# Altium schematic sheet COMECA_Main.SchDoc
size A4; SheetNumber: 1; SheetTotal: 10
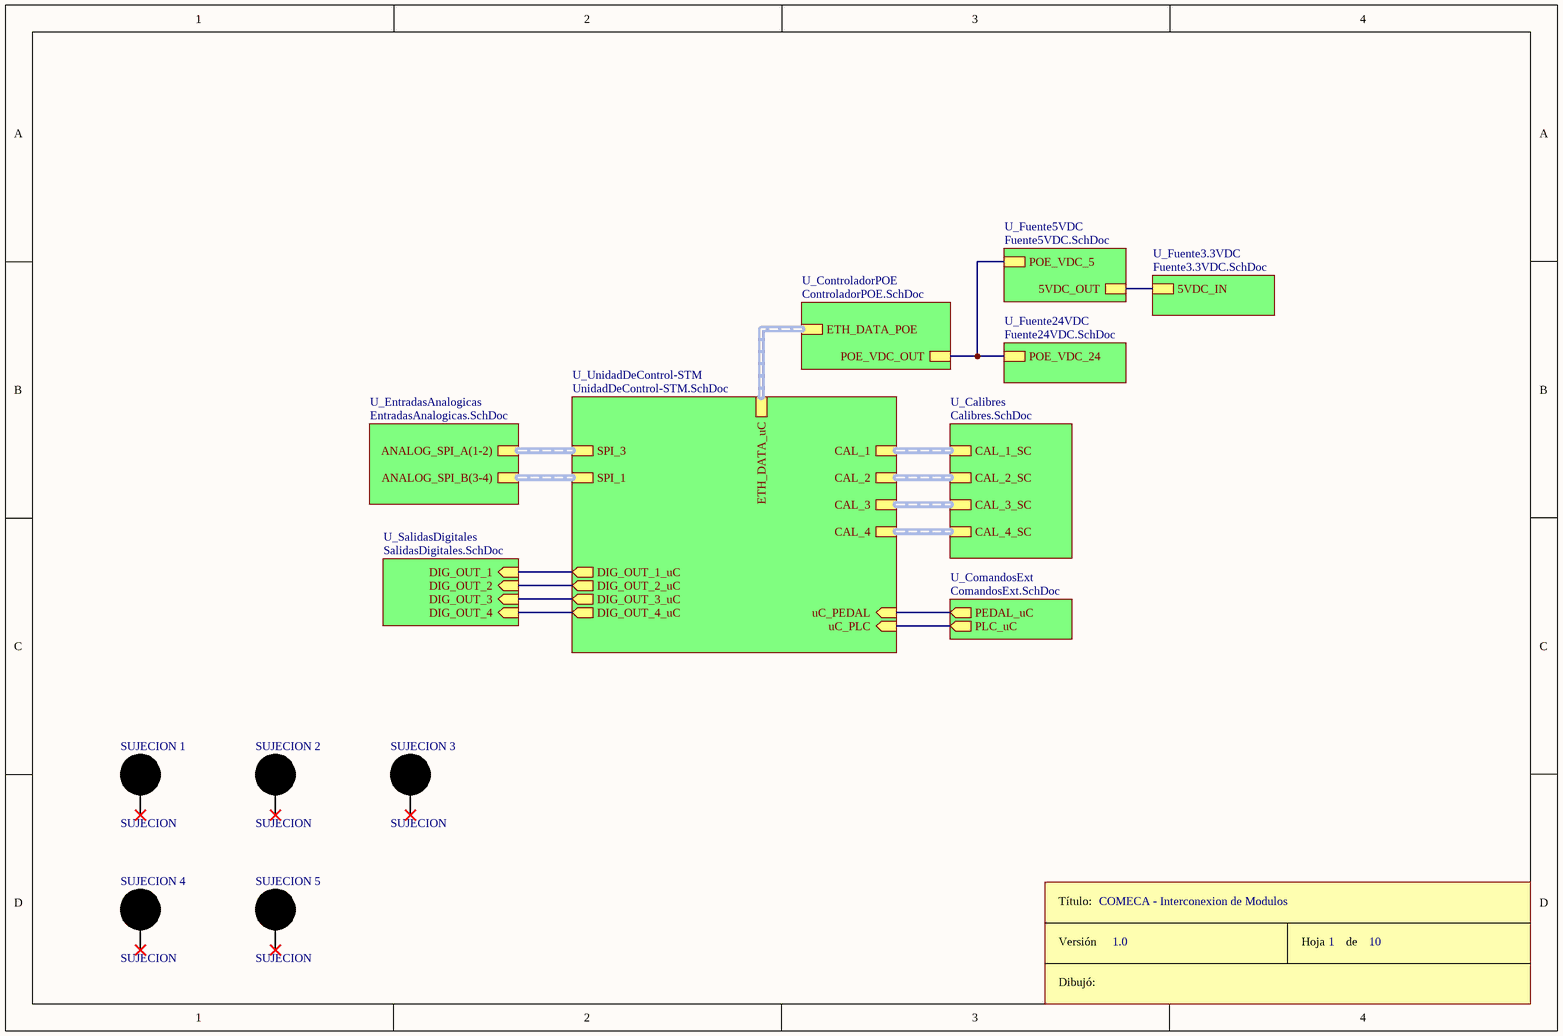
[diagram p0: COMECA_Main.SchDoc]

## Parts
ROT9  Rótulo  (value not drawn)  (graphical)
SUJECION_1  SUJECION  [SUJECION (5.00MM - 3.50MM)]
SUJECION_2  SUJECION  [SUJECION (5.00MM - 3.50MM)]
SUJECION_3  SUJECION  [SUJECION (5.00MM - 3.50MM)]
SUJECION_4  SUJECION  [SUJECION (5.00MM - 3.50MM)]
SUJECION_5  SUJECION  [SUJECION (5.00MM - 3.50MM)]

## Sub-sheets
U_Calibres = Calibres.SchDoc: CAL_4_SC (harness CALIBRE), CAL_3_SC (harness CALIBRE), CAL_2_SC (harness CALIBRE), CAL_1_SC (harness CALIBRE)
U_ComandosExt = ComandosExt.SchDoc: PLC_uC (out), PEDAL_uC (out)
U_ControladorPOE = ControladorPOE.SchDoc: POE_VDC_OUT, ETH_DATA_POE (harness ETH_DATA)
U_EntradasAnalogicas = EntradasAnalogicas.SchDoc: ANALOG_SPI_A(1-2) (harness ANALOG_SPI), ANALOG_SPI_B(3-4) (harness ANALOG_SPI)
U_Fuente3.3VDC = Fuente3.3VDC.SchDoc: 5VDC_IN
U_Fuente5VDC = Fuente5VDC.SchDoc: POE_VDC_5, 5VDC_OUT
U_Fuente24VDC = Fuente24VDC.SchDoc: POE_VDC_24
U_SalidasDigitales = SalidasDigitales.SchDoc: DIG_OUT_4 (in), DIG_OUT_2 (in), DIG_OUT_3 (in), DIG_OUT_1 (in)
U_UnidadDeControl-STM = UnidadDeControl-STM.SchDoc: uC_PLC (in), uC_PEDAL (in), SPI_1 (harness ANALOG_SPI), SPI_3 (harness ANALOG_SPI), CAL_2 (harness CALIBRE), CAL_3 (harness CALIBRE), CAL_4 (harness CALIBRE), CAL_1 (harness CALIBRE), DIG_OUT_3_uC (out), DIG_OUT_2_uC (out), DIG_OUT_1_uC (out), DIG_OUT_4_uC (out), ETH_DATA_uC (harness ETH_DATA)

## Nets
(unnamed): sheet U_ControladorPOE/POE_VDC_OUT, sheet U_Fuente5VDC/POE_VDC_5, sheet U_Fuente24VDC/POE_VDC_24
(unnamed): sheet U_Fuente5VDC/5VDC_OUT, sheet U_Fuente3.3VDC/5VDC_IN
(unnamed): sheet U_ComandosExt/PLC_uC, sheet U_UnidadDeControl-STM/uC_PLC
(unnamed): sheet U_ComandosExt/PEDAL_uC, sheet U_UnidadDeControl-STM/uC_PEDAL
(unnamed): sheet U_UnidadDeControl-STM/DIG_OUT_3_uC, sheet U_SalidasDigitales/DIG_OUT_3
(unnamed): sheet U_UnidadDeControl-STM/DIG_OUT_2_uC, sheet U_SalidasDigitales/DIG_OUT_2
(unnamed): sheet U_UnidadDeControl-STM/DIG_OUT_1_uC, sheet U_SalidasDigitales/DIG_OUT_1
(unnamed): sheet U_UnidadDeControl-STM/DIG_OUT_4_uC, sheet U_SalidasDigitales/DIG_OUT_4

Not connected (* = marked no-connect by the designer): SUJECION_1 1*; SUJECION_2 1*; SUJECION_3 1*; SUJECION_4 1*; SUJECION_5 1*

## Buses and harness runs
harness sheet U_Calibres/CAL_1_SC = sheet U_UnidadDeControl-STM/CAL_1
harness sheet U_Calibres/CAL_2_SC = sheet U_UnidadDeControl-STM/CAL_2
harness sheet U_Calibres/CAL_3_SC = sheet U_UnidadDeControl-STM/CAL_3
harness sheet U_Calibres/CAL_4_SC = sheet U_UnidadDeControl-STM/CAL_4
harness sheet U_ControladorPOE/ETH_DATA_POE = sheet U_UnidadDeControl-STM/ETH_DATA_uC
harness sheet U_EntradasAnalogicas/ANALOG_SPI_A(1-2) = sheet U_UnidadDeControl-STM/SPI_3
harness sheet U_EntradasAnalogicas/ANALOG_SPI_B(3-4) = sheet U_UnidadDeControl-STM/SPI_1

## Notes on the sheet
- COMECA - Interconexion de Modulos
- 1.0
- 1
- 10
- (in symbol Rótulo) Título:; Versión; Hoja       de; Dibujó: